# EAGLE design ICE_mod_hbridge_m8 (EAGLE 5.06)
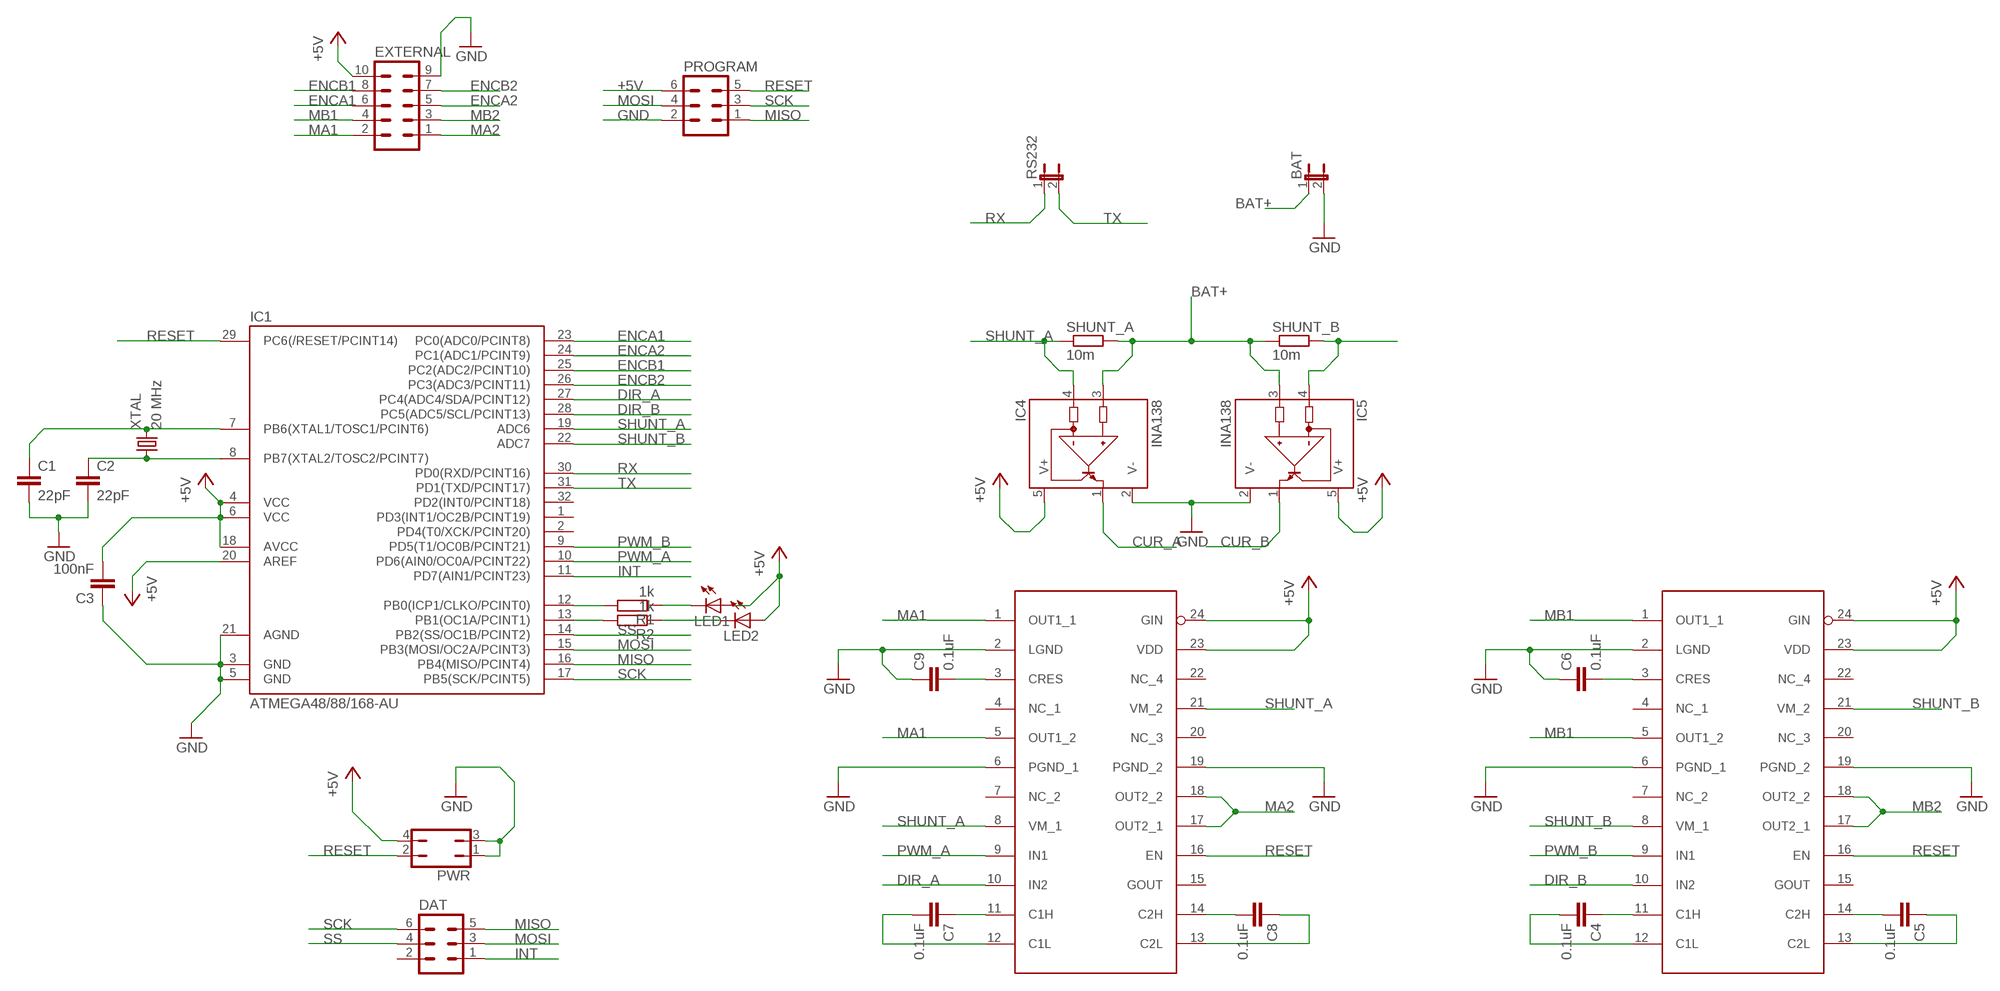
[diagram p0: schematic, sheet 1]

## Parts
BAT  JP1E  [JP1]
C1  22pF  C-EUC0805K  [C0805K]
C2  22pF  C-EUC0805K  [C0805K]
C3  100nF  C-EUC0805K  [C0805K]
C4  0.1uF  C-EUC0805K  [C0805K]
C5  0.1uF  C-EUC0805K  [C0805K]
C6  0.1uF  C-EUC0805K  [C0805K]
C7  0.1uF  C-EUC0805K  [C0805K]
C8  0.1uF  C-EUC0805K  [C0805K]
C9  0.1uF  C-EUC0805K  [C0805K]
DAT  MA03-2  [MA03-2]
EXTERNAL  MA05-2  [MA05-2]
IC1  ATMEGA48/88/168-AU  [TQFP32-08]
IC2  MPC17510  [TSSOP24]
IC3  MPC17510  [TSSOP24]
IC4  INA138  [SOT23-5]
IC5  INA138  [SOT23-5]
LED1  LEDCHIPLED_0805  [CHIPLED_0805]
LED2  LEDCHIPLED_0805  [CHIPLED_0805]
PROGRAM  MA03-2  [MA03-2]
PWR  JP2Q  [JP2Q]
R1  1k  R-EU_R0805W  [R0805W]
R2  1k  R-EU_R0805W  [R0805W]
RS232  JP1E  [JP1]
SHUNT_A  10m  R-EU_R2010  [R2010]
SHUNT_B  10m  R-EU_R2010  [R2010]
XTAL  20 MHz  CRYSTALHC49S  [HC49/S]

## Nets
+5V: C3.2 EXTERNAL.10 IC1.4(VCC) IC1.6(VCC) IC1.18(AVCC) IC1.20(AREF) IC2.23(VDD) IC2.24(GIN) IC3.23(VDD) IC3.24(GIN) IC4.5(V+) IC5.5(V+) LED1.A LED2.A PROGRAM.6 PWR.4
BAT+: BAT.1 IC4.3(IN+) IC5.3(IN+) SHUNT_A.2 SHUNT_B.1
CUR_A: IC4.1(OUT)
CUR_B: IC5.1(OUT)
DIR_A: IC1.27(PC4(ADC4/SDA/PCINT12)) IC2.10(IN2)
DIR_B: IC1.28(PC5(ADC5/SCL/PCINT13)) IC3.10(IN2)
ENCA1: EXTERNAL.6 IC1.23(PC0(ADC0/PCINT8))
ENCA2: EXTERNAL.5 IC1.24(PC1(ADC1/PCINT9))
ENCB1: EXTERNAL.8 IC1.25(PC2(ADC2/PCINT10))
ENCB2: EXTERNAL.7 IC1.26(PC3(ADC3/PCINT11))
GND: BAT.2 C1.2 C2.2 C3.1 C6.1 C9.1 EXTERNAL.9 IC1.3(GND) IC1.5(GND) IC1.21(AGND) IC2.2(LGND) IC2.6(PGND_1) IC2.19(PGND_2) IC3.2(LGND) IC3.6(PGND_1) IC3.19(PGND_2) IC4.2(V-) IC5.2(V-) PROGRAM.2 PWR.1 PWR.3
INT: DAT.1 IC1.11(PD7(AIN1/PCINT23))
MA1: EXTERNAL.2 IC2.1(OUT1_1) IC2.5(OUT1_2)
MA2: EXTERNAL.1 IC2.17(OUT2_1) IC2.18(OUT2_2)
MB1: EXTERNAL.4 IC3.1(OUT1_1) IC3.5(OUT1_2)
MB2: EXTERNAL.3 IC3.17(OUT2_1) IC3.18(OUT2_2)
MISO: DAT.5 IC1.16(PB4(MISO/PCINT4)) PROGRAM.1
MOSI: DAT.3 IC1.15(PB3(MOSI/OC2A/PCINT3)) PROGRAM.4
N$1: C1.1 IC1.7(PB6(XTAL1/TOSC1/PCINT6)) XTAL.2
N$3: C7.1 IC2.11(C1H)
N$4: C7.2 IC2.12(C1L)
N$5: C8.2 IC2.14(C2H)
N$6: C8.1 IC2.13(C2L)
N$7: C4.1 IC3.11(C1H)
N$8: C9.2 IC2.3(CRES)
N$9: C4.2 IC3.12(C1L)
N$10: C5.2 IC3.14(C2H)
N$11: C5.1 IC3.13(C2L)
N$12: C6.2 IC3.3(CRES)
N$13: IC1.12(PB0(ICP1/CLKO/PCINT0)) R1.2
N$14: IC1.13(PB1(OC1A/PCINT1)) R2.2
N$15: LED1.C R1.1
N$16: LED2.C R2.1
N$24: C2.1 IC1.8(PB7(XTAL2/TOSC2/PCINT7)) XTAL.1
PWM_A: IC1.10(PD6(AIN0/OC0A/PCINT22)) IC2.9(IN1)
PWM_B: IC1.9(PD5(T1/OC0B/PCINT21)) IC3.9(IN1)
RESET: IC1.29(PC6(/RESET/PCINT14)) IC2.16(EN) IC3.16(EN) PROGRAM.5 PWR.2
RX: IC1.30(PD0(RXD/PCINT16)) RS232.1
SCK: DAT.6 IC1.17(PB5(SCK/PCINT5)) PROGRAM.3
SHUNT_A: IC1.19(ADC6) IC2.8(VM_1) IC2.21(VM_2) IC4.4(IN-) SHUNT_A.1
SHUNT_B: IC1.22(ADC7) IC3.8(VM_1) IC3.21(VM_2) IC5.4(IN-) SHUNT_B.2
SS: DAT.4 IC1.14(PB2(SS/OC1B/PCINT2))
TX: IC1.31(PD1(TXD/PCINT17)) RS232.2
Unconnected: DAT.2 IC1.1(PD3(INT1/OC2B/PCINT19)) IC1.2(PD4(T0/XCK/PCINT20)) IC1.32(PD2(INT0/PCINT18)) IC2.4(NC_1) IC2.7(NC_2) IC2.15(GOUT) IC2.20(NC_3) IC2.22(NC_4) IC3.4(NC_1) IC3.7(NC_2) IC3.15(GOUT) IC3.20(NC_3) IC3.22(NC_4)

## Library data of the parts
BAT RS232 = jumper:JP1E: JUMPER
C1-C9 = rcl:C-EU: CAPACITOR, European symbol
DAT PROGRAM = con-lstb:MA03-2: PIN HEADER
EXTERNAL = con-lstb:MA05-2: PIN HEADER
IC1 = atmega8:ATMEGA48/88/168
IC2 IC3 = mpc17510:MPC17510
IC4 IC5 = burr-brown:INA138: High-Side Measurement Current Shunt Monitor
LED1 LED2 = led:LED: LED OSRAM: - CHIPLED LG R971, LG N971, LY N971, LG Q971, LY Q971, LO R971, LY R971 LH N974, LH R974 LS Q976, LO Q976, LY Q976 LO Q996 - Hyper CHIPLED LW Q18S LB Q993, LB Q99A, LB R99A - SideLED LS A670, LO A670, LY A670, LG A670, LP A670 LB A673, LV A673, LT A673, LW A673 LH A674 LY A675 LS A676, LA A676, LO A676, LY A676, LW A676 LS A679, LY A679, LG A679 - Hyper Micro SIDELED® LS Y876, LA Y876, LO Y876, LY Y876 LT Y87S - SmartLED LW L88C, LW L88S LB L89C, LB L89S, LG L890 LS L89K, LO L89K, LY L89K LS L896, LA L896, LO L896, LY L896 - TOPLED LS T670, LO T670, LY T670, LG T670, LP T670 LSG T670, LSP T670, LSY T670, LOP T670, LYG T670 LG T671, LOG T671, LSG T671 LB T673, LV T673, LT T673, LW T673 LH T674 LS T676, LA T676, LO T676, LY T676, LB T676, LH T676, LSB T676, LW T676 LB T67C, LV T67C, LT T67C, LS T67K, LO T67K, LY T67K, LW E67C LS E67B, LA E67B, LO E67B, LY E67B, LB E67C, LV E67C, LT E67C LW T67C LS T679, LY T679, LG T679 LS T770, LO T770, LY T770, LG T770, LP T770 LB T773, LV T773, LT T773, LW T773 LH T774 LS E675, LA E675, LY E675, LS T675 LS T776, LA T776, LO T776, LY T776, LB T776 LHGB T686 LT T68C, LB T68C - Hyper Mini TOPLED® LB M676 - Mini TOPLED Santana® LG M470 LS M47K, LO M47K, LY M47K Source: http://www.osram.convergy.de LUXEON: - LUMILED® LXK2-PW12-R00, LXK2-PW12-S00, LXK2-PW14-U00, LXK2-PW14-V00 LXK2-PM12-R00, LXK2-PM12-S00, LXK2-PM14-U00 LXK2-PE12-Q00, LXK2-PE12-R00, LXK2-PE12-S00, LXK2-PE14-T00, LXK2-PE14-U00 LXK2-PB12-K00, LXK2-PB12-L00, LXK2-PB12-M00, LXK2-PB14-N00, LXK2-PB14-P00, LXK2-PB14-Q00 LXK2-PR12-L00, LXK2-PR12-M00, LXK2-PR14-Q00, LXK2-PR14-R00 LXK2-PD12-Q00, LXK2-PD12-R00, LXK2-PD12-S00 LXK2-PH12-R00, LXK2-PH12-S00 LXK2-PL12-P00, LXK2-PL12-Q00, LXK2-PL12-R00 Source: www.luxeon.com KINGBRIGHT: KA-3528ASYC Source: www.kingbright.com
PWR = jumper:JP2Q: JUMPER
R1 R2 = rcl:R-EU_: RESISTOR, European symbol
SHUNT_A SHUNT_B = resistor:R-EU_: RESISTOR, European symbol
XTAL = crystal:CRYSTAL: CRYSTAL

## Board
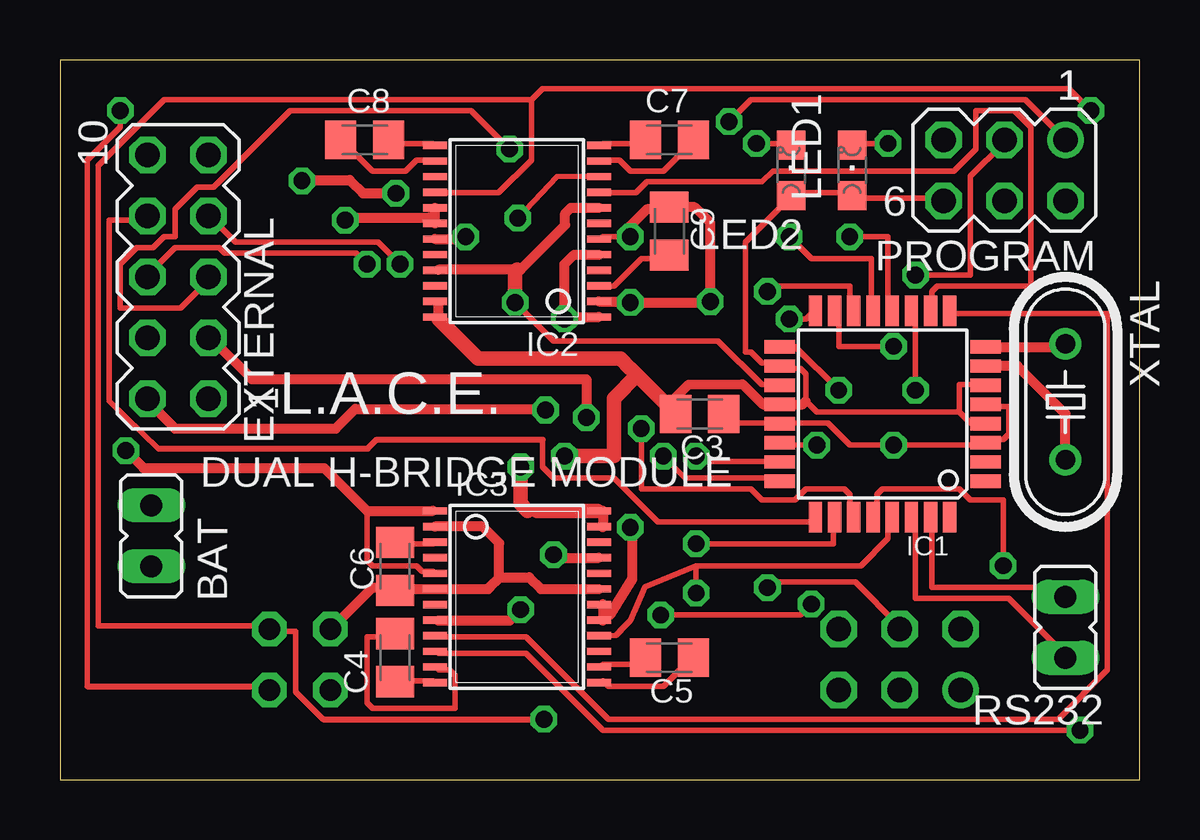
[diagram p1: board, top side]
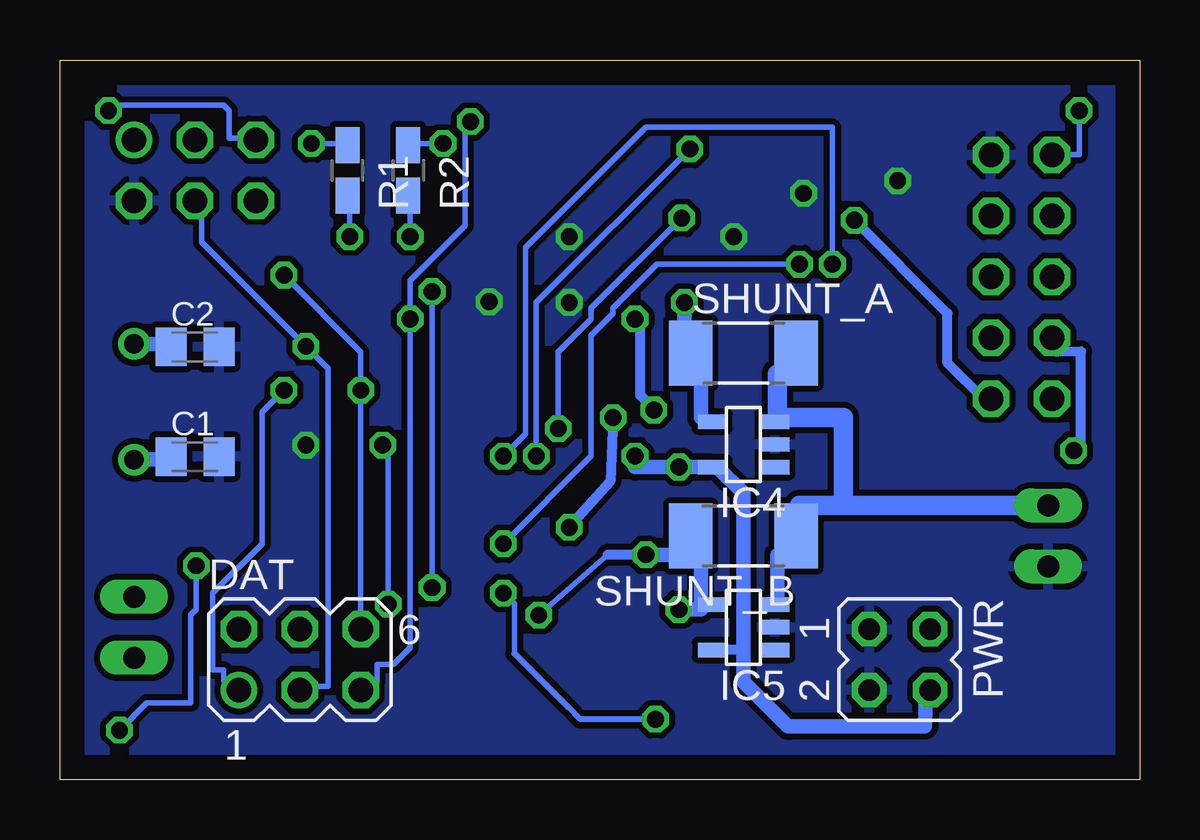
[diagram p2: board, bottom side, seen from below]

Size 45 x 30 mm. Coordinates in mm from the lower left corner, seen from the top.
Outline: 0,0 45,0 45,30 0,30 0,0
Copper layers (1*16): Top 0.035mm / dielectric 1.5mm / Bottom 0.035mm
Design rules "olimex-8mils": minimum track width 8mil, minimum drill 0.6mm, track to track 8mil, track to pad 8mil, pad to pad 8mil, via to via 8mil, smd to smd 8mil, copper to edge 40mil, drill to drill 10mil, minimum pad ring 10mil, minimum via ring 8mil, stop-mask expansion 0mil, vias tented up to drill 0mil, thermal gap 10mil

### Footprints (pad centres in the part's own frame; a part is rotated, then mirrored left to right if it is on the bottom)
JP1 = drill 0.914 long: 1 0,-1.27; 2 0,1.27
C0805K = smd 1.3 x 1.6: 1 -1,0; 2 1,0
MA03-2 = drill 1.016 round: 1 -2.54,-1.27 | drill 1.016 octagon: 2 -2.54,1.27; 3 0,-1.27; 4 0,1.27; 5 2.54,-1.27; 6 2.54,1.27
MA05-2 = drill 1.016 octagon: 1 -5.08,-1.27; 2 -5.08,1.27; 3 -2.54,-1.27; 4 -2.54,1.27; 5 0,-1.27; 6 0,1.27; 7 2.54,-1.27; 8 2.54,1.27; 9 5.08,-1.27; 10 5.08,1.27
TQFP32-08 = smd 1.27 x 0.559: 1 -4.293,2.8; 2 -4.293,2; 3 -4.293,1.2; 4 -4.293,0.4; 5 -4.293,-0.4; 6 -4.293,-1.2; 7 -4.293,-2; 8 -4.293,-2.8; 17 4.293,-2.8; 18 4.293,-2; 19 4.293,-1.2; 20 4.293,-0.4; 21 4.293,0.4; 22 4.293,1.2; 23 4.293,2; 24 4.293,2.8 | smd 0.559 x 1.27: 9 -2.8,-4.293; 10 -2,-4.293; 11 -1.2,-4.293; 12 -0.4,-4.293; 13 0.4,-4.293; 14 1.2,-4.293; 15 2,-4.293; 16 2.8,-4.293; 25 2.8,4.293; 26 2,4.293; 27 1.2,4.293; 28 0.4,4.293; 29 -0.4,4.293; 30 -1.2,4.293; 31 -2,4.293; 32 -2.8,4.293
TSSOP24 = smd 0.305 x 0.991: 1 -3.575,-3.418; 2 -2.925,-3.418; 3 -2.275,-3.418; 4 -1.625,-3.418; 5 -0.975,-3.418; 6 -0.325,-3.418; 7 0.325,-3.418; 8 0.975,-3.418; 9 1.625,-3.418; 10 2.275,-3.418; 11 2.925,-3.418; 12 3.575,-3.418; 13 3.575,3.418; 14 2.925,3.418; 15 2.275,3.418; 16 1.625,3.418; 17 0.975,3.418; 18 0.325,3.418; 19 -0.325,3.418; 20 -0.975,3.418; 21 -1.625,3.418; 22 -2.275,3.418; 23 -2.925,3.418; 24 -3.575,3.418
SOT23-5 = smd 0.6 x 1.2: 1 -0.95,-1.306; 2 0,-1.306; 3 0.95,-1.306; 4 0.95,1.306; 5 -0.95,1.306
CHIPLED_0805 = smd 1.2 x 1.2: A 0,-1.05; C 0,1.05
JP2Q = drill 0.914 octagon: 1 -1.27,-1.27; 2 -1.27,1.27; 3 1.27,-1.27; 4 1.27,1.27
R0805W = smd 1.5 x 1: 1 -1.052,0; 2 1.052,0
R2010 = smd 1.8 x 2.7: 1 -2.2,0; 2 2.2,0
HC49/S = drill 0.813 round: 1 -2.413,0; 2 2.413,0

### Placement (x,y rotation side)
BAT  3.81,10.16 180 top
C1  39.37,13.46 0 bottom
C2  39.37,18.03 0 bottom
C3  26.67,15.24 180 top
C4  13.97,5.08 270 top
C5  25.4,5.08 180 top
C6  13.97,8.89 90 top
C7  25.4,26.67 180 top
C8  12.7,26.67 180 top
C9  25.4,22.86 270 top
DAT  35,5 0 bottom
EXTERNAL  4.92,20.96 90 top
IC1  34.29,15.24 180 top
IC2  19.05,22.86 90 top
IC3  19.05,7.62 270 top
IC4  16.51,13.97 90 bottom
IC5  16.51,6.35 90 bottom
LED1  33.02,25.4 0 top
LED2  30.48,25.4 0 top
PROGRAM  39.37,25.4 180 top
PWR  10,5 270 bottom
R1  33.02,25.4 270 bottom
R2  30.48,25.4 270 bottom
RS232  41.91,6.35 0 top
SHUNT_A  16.51,17.78 0 bottom
SHUNT_B  16.51,10.16 180 bottom
XTAL  41.91,15.75 270 top

### Tracks (layer width: path | path; a pad name or v marks a point on that pad's centre or on a via)
+5V  (via drill 0.7)
  Top 0.229: PROGRAM.6 36.8,24.23 33.15,24.23 LED1.A 32.92,24.46 30.63,24.46 LED2.A 30.4,24.23 28.57,22.4 28.57,17.83 28.8,17.83 29.26,17.37 29.95,17.37 IC1.18 30.18,17.14 30.86,17.14 31.09,16.92 31.09,15.77 31.55,15.32 37.49,15.32 | 22.63,10.52 IC3.23 | 22.4,11.2 IC3.24 | 37.49,15.32 37.95,14.86 38.41,14.86 IC1.4 | 37.49,15.32 37.49,16.46 38.41,16.46 IC1.6 | 15.77,19.43 IC2.24 15.77,19.2 | 15.77,19.89 IC2.23 | 25.6,15.32 C3.2 | v2.52,27.89 2.52,27.2 1.14,25.83 1.14,3.89
  Top 0.254: 8.69,3.89 PWR.4 8.57,3.89 1.14,3.89
  Top 0.406: 22.63,10.52 22.63,11.2 IC3.24 | 15.77,19.43 15.77,19.89 | 25.6,15.32 25.33,15.59 26.2,16.46 28.45,16.49 29.31,15.64 IC1.20 30.96,15.64 31.09,15.77 | 19.89,11.2 19.88,11.21 19.5,11.21 | v19.2,13.03 | 23.07,13.49 23.08,13.5
  Top 0.61: 24.06,16.86 23.77,17.14 23.76,17.14 23.36,17.55 17.43,17.55 15.77,19.2 | 24.06,16.86 25.33,15.59 | 19.89,11.2 22.4,11.2 | 19.5,11.21 19.2,11.5 v19.2,13.03 | v21.03,13.49 23.07,13.49 | 23.08,13.5 23.08,15.89 24.06,16.86
  Bottom 0.229: IC4.5 | v2.52,27.89 2.52,26.06 3.43,26.06 EXTERNAL.10
  Bottom 0.406: PWR.4 8.91,3.66 | 17.59,13.02 IC4.5 | 16.73,5.4 IC5.5 | 16.73,5.4 16.69,5.44 | 16.73,5.4 16.51,5.4 16.51,5.33
  Bottom 0.61: IC4.5 v19.2,13.03 21.03,13.03 v21.03,13.49 | 8.91,3.66 8.95,2.22 14.58,2.21 14.65,2.21 16.51,4.06 16.51,5.33 16.51,11.94 17.59,13.02
BAT+
  Bottom 0.229: 14.4,17.6 SHUNT_A.2 | 15.09,9.37 14.4,10.06 SHUNT_B.1 14.17,10.29 14.17,11.43 | 15.09,7.32 IC5.3 | 15.09,15.09 IC4.3
  Bottom 0.61: 15.09,16.92 14.4,17.6 | 15.09,9.37 15.09,7.32
  Bottom 0.813: 15.09,16.92 15.09,15.09 12.34,15.09 12.34,11.43 | 12.34,11.43 14.17,11.43 | BAT.1 12.34,11.43
DIR_A  (via drill 0.7)
  Top 0.229: v19.09,23.41 20.72,25.13 22.4,25.15 IC2.10 | v24.23,14.63 24.23,12.12 28.8,12.12 29.26,11.66 30.63,11.66 31.09,12.12 32.69,12.12 32.92,11.89 32.92,10.97 IC1.27
  Bottom 0.229: v19.09,23.41 22.86,19.66 22.86,19.2 24.23,17.83 v24.23,14.63
DIR_B  (via drill 0.7)
  Top 0.229: v42.52,2.06 22.63,2.06 19.43,5.26 15.77,5.26 IC3.10 | v39.32,8.91 39.32,11.66 37.95,11.66 37.49,12.12 34.29,12.12 34.06,11.89 34.06,10.97 IC1.28
  Bottom 0.229: v42.52,2.06 41.38,3.2 39.55,3.2 39.55,6.86 39.32,7.09 v39.32,8.91
ENCA1  (via drill 0.7)
  Top 0.229: v26.52,13.49 26.75,13.26 29.95,13.26 IC1.23 | v12.8,21.49 12.34,21.95 6.86,21.95 6.63,22.17 4.8,22.17 3.66,21.03 EXTERNAL.6
  Bottom 0.229: v26.52,13.49 25.6,14.4 25.6,22.17 20.57,27.2 12.8,27.2 v12.8,21.49
ENCA2  (via drill 0.7)
  Top 0.229: v25.15,13.49 26.06,12.57 29.95,12.57 IC1.24 | v18.75,26.29 17.14,27.89 9.6,27.89 6.4,24.69 5.71,24.69 4.8,23.77 4.8,22.63 4.34,22.63 3.89,22.17 3.2,22.17 2.52,21.49 2.52,19.66 5.03,19.66 6.17,20.8 EXTERNAL.5
  Bottom 0.229: v25.15,13.49 25.15,19.89 v18.75,26.29
ENCB1
  Top 0.229: 20.12,14.17 20.12,13.03 20.57,12.57 23.09,12.57 24.92,10.74 31.32,10.74 IC1.25 | 4.12,13.79 2.06,15.77 2.06,23.32 3.43,23.32 EXTERNAL.8
  Top 0.254: 20.12,14.17 13.2,14.17 12.82,13.79 4.13,13.79 4.12,13.79
ENCB2  (via drill 0.7)
  Top 0.229: v26.52,9.83 32.23,9.83 32.23,10.74 IC1.26 | v14.17,21.49 13.26,22.4 7.32,22.4 6.4,23.32 EXTERNAL.7
  Bottom 0.229: v26.52,9.83 22.86,13.49 22.86,18.52 21.95,19.43 21.95,19.66 20.12,21.49 v14.17,21.49
GND  (via drill 0.7)
  Top 0.229: IC1.5 38.63,15.54 39.55,15.54 39.55,14.4 39.32,14.17 38.63,14.17 IC1.3 38.41,13.95 v34.75,13.95 32.92,13.95 32,14.86 30.18,14.86 IC1.21 29.95,14.86 28.12,14.86 27.89,15.09 C3.1 | 14.17,8 C6.1 13.95,8 | 17.91,8 16.92,8 | 23.55,22.86 23.32,22.63 22.63,22.63 IC2.6 | C9.1 25.38,23.77
  Top 0.406: 25.38,23.77 24.46,23.77 23.55,22.86 v23.77,22.63 | 13.95,8 13.03,8 11.43,6.4 PWR.1 | C6.1 14.03,7.95 IC3.6 17.86,7.95 17.91,8 18.35,8.43 | C9.1 26.46,23.86 27.11,23.21 v27.11,19.92 27.08,19.89 v23.77,19.89 23.73,19.93 IC2.2 | IC2.19 16.82,22.54 v16.92,22.63 | v14.01,24.44 12.63,24.44 12.07,24.99 10.14,24.99 10.09,24.94 | IC3.19 20.05,7.95 19.56,8.43 18.35,8.43 | IC3.2 17.62,10.54 18.3,9.86 18.3,8.48 18.35,8.43
  other vias: 10.09,24.97
  pour Bottom (isolate 0.254): 0,30.48 45.72,30.48 45.72,0 0,0
INT  (via drill 0.7)
  Top 0.229: v35.66,16.23 35.66,19.43 IC1.11
  Bottom 0.229: v35.66,16.23 36.58,15.32 36.58,9.83 38.63,7.77 38.63,4.57 38.18,4.57 38.18,4.12 37.72,3.66 DAT.1
MA1  (via drill 0.7)
  Top 0.254: 20.2,15.45 v20.24,15.41
  Top 0.406: EXTERNAL.2 3.66,15.77 4.8,14.63 11.49,14.63 12.31,15.45 20.2,15.45 | IC2.1 21.11,19.29 v21.03,19.2 21.03,21.49 21.43,21.89 IC2.5
  Bottom 0.406: v21.03,19.2 20.8,18.97 20.8,16 v20.24,15.41
MA2  (via drill 0.7)
  Top 0.406: v11.89,23.32 11.89,23.34 11.98,23.43 15.39,23.43 IC2.18 IC2.17
  Bottom 0.406: v11.89,23.32 8,19.43 8,17.37 6.4,15.77 EXTERNAL.1
MB1  (via drill 0.7)
  Top 0.229: 12.8,11.2 12.8,9.14 13.03,8.91 14.86,8.91 15.09,8.69 15.54,8.69 IC3.5 | 15.54,11.2 IC3.1
  Top 0.406: 15.54,11.2 12.8,11.2 11.02,12.99 3.48,12.99 2.75,13.72 v2.74,13.72
  Bottom 0.406: v2.74,13.72 2.45,13.96 2.45,17.85 3.43,17.83 3.43,18.29 EXTERNAL.4
MB2  (via drill 0.7)
  Top 0.229: 22.63,6.63 IC3.17 | 22.63,7.32 IC3.18
  Top 0.406: 22.63,6.63 22.63,7.32 22.93,6.88 23.84,8.36 23.84,10.45 v23.77,10.52 | v21.95,15.09 21.95,16.69 8,16.69 6.4,18.29 EXTERNAL.3
  Bottom 0.406: v23.77,10.52 22.06,12.43 v21.95,15.09
MISO  (via drill 0.7)
  Top 0.229: v30.4,19.2 31.09,19.2 31.32,19.43 IC1.16 | v27.89,27.43 28.8,28.35 40.23,28.35 PROGRAM.1
  Bottom 0.229: DAT.5 32.23,3.66 31.77,4.12 31.77,4.8 31.09,4.8 30.4,5.49 v30.4,19.2 30.4,20.8 28.12,23.09 28.12,27.2 v27.89,27.43
MOSI  (via drill 0.7)
  Top 0.229: v34.75,18.06 32.46,18.06 32.46,19.43 IC1.15
  Bottom 0.229: PROGRAM.4 39.32,24 39.09,23.77 39.09,22.4 v34.75,18.06 33.83,17.14 33.83,3.89 34.98,3.89 DAT.3
N$1
  Top 0.406: IC1.7 39.91,17.24 41.91,15.24 XTAL.2
  Bottom 0.406: C1.1 40.5,13.34
  Bottom 0.61: 40.5,13.34 XTAL.2
N$3
  Top 0.229: IC2.11 22.63,25.83 23.32,25.83 23.77,25.38 25.15,25.38 26.29,26.52 C7.1
N$4
  Top 0.229: IC2.12 22.63,26.52 24.23,26.52 C7.2
N$5
  Top 0.229: IC2.14 15.54,25.83 14.86,25.83 14.4,25.38 13.03,25.38 11.89,26.52 C8.2
N$6
  Top 0.229: IC2.13 15.54,26.52 13.72,26.52 C8.1
N$7
  Top 0.229: IC3.11 15.77,4.57 16.23,4.57 16.46,4.34 16.46,2.97 13.03,2.97 12.8,3.2 12.8,5.94 13.95,5.94 C4.1
N$8
  Top 0.229: IC2.3 22.63,20.57 23.09,20.57 24.23,21.72 25.38,21.72 C9.2
N$9
  Top 0.229: IC3.12 15.54,4.12 14.17,4.12 C4.2
N$10
  Top 0.229: IC3.14 22.63,4.8 24,4.8 24.23,5.03 C5.2
N$11
  Top 0.229: IC3.13 22.63,4.12 22.86,3.89 25.15,3.89 26.29,5.03 C5.1
N$12
  Top 0.229: IC3.3 15.54,9.83 14.17,9.83 C6.2
N$13  (via drill 0.7)
  Top 0.229: v32.92,22.63 34.52,22.63 34.52,19.66 IC1.12
  Bottom 0.229: v32.92,22.63 32.92,24.23 R1.2
N$14  (via drill 0.7)
  Top 0.229: v30.4,22.63 31.32,21.72 33.83,21.72 33.83,19.66 IC1.13
  Bottom 0.229: v30.4,22.63 30.4,24.23 R2.2
N$15  (via drill 0.7)
  Top 0.229: v34.52,26.52 33.15,26.52 LED1.C
  Bottom 0.229: v34.52,26.52 33.15,26.52 LED1.C
N$16  (via drill 0.7)
  Top 0.229: v29.03,26.52 30.4,26.52 LED2.C
  Bottom 0.229: v29.03,26.52 30.4,26.52 LED2.C
N$24
  Top 0.406: IC1.8 41.91,18.04 XTAL.1
  Bottom 0.406: 40.5,18.16 C2.1
  Bottom 0.61: XTAL.1 40.5,18.16
PWM_A
  Top 0.229: IC2.9 22.63,24.46 24,24.46 24.46,24.92 29.26,24.92 29.72,25.38 37.26,25.38 38.18,26.29 38.18,27.89 39.78,27.89 40.46,27.2 40.46,20.57 36.58,20.57 36.35,20.34 36.35,19.66 IC1.10
PWM_B
  Top 0.229: IC3.9 15.77,5.94 19.43,5.94 22.86,2.52 41.6,2.52 43.66,4.57 43.66,19.43 37.26,19.43 IC1.9
RESET  (via drill 0.7)
  Top 0.229: 26.52,8.91 33.38,8.91 34.52,10.06 34.52,10.74 IC1.29 | 26.52,8.91 24.38,8.04 23.77,6.63 23.32,6.17 23.41,6.24 23.18,6.01 IC3.16 | 19.66,28.35 19.66,25.83 18.29,24.46 15.77,24.46 IC2.16 | 19.66,28.35 4.34,28.35 1.6,25.6 1.6,6.4 8.69,6.4 PWR.2 8.91,6.17 9.83,6.17 9.83,3.66 10.97,2.52 | v42.98,27.89 42.06,28.8 20.12,28.8 19.66,28.35 | v26.52,7.77 26.52,8.91
  Top 0.254: 10.97,2.52 v20.18,2.52
  Bottom 0.229: v42.98,27.89 42.98,28.12 38.18,28.12 37.95,27.89 37.95,26.75 37.03,26.75 PROGRAM.5 | v26.52,7.77 26.06,7.32 26.06,5.26
  Bottom 0.254: 26.06,5.26 23.83,3.03 23.32,2.52 v20.18,2.52
RX
  Top 0.229: IC1.30 35.66,10.74 35.66,7.54 39.55,7.54 41.83,5.26 RS232.1
SCK  (via drill 0.7)
  Top 0.229: v32.46,16.23 30.63,18.06 30.18,18.06 IC1.17 | v35.66,21.03 37.95,21.03 37.95,25.15 39.32,26.52 PROGRAM.3
  Bottom 0.229: DAT.6 32.46,6.4 v32.46,16.23 32.46,17.83 v35.66,21.03
SHUNT_A  (via drill 0.7)
  Top 0.229: 15.77,21.26 IC2.21 | v18.97,19.89 20.57,18.29 27.43,18.29 29.26,16.46 29.95,16.46 IC1.19
  Top 0.406: IC2.8 21.3,23.84 21.06,23.6 21.06,23.12 19.2,21.26 19.05,21.26 15.77,21.26
  Top 0.61: v18.97,19.89 18.97,21.18 19.05,21.26
  Bottom 0.229: 18.29,15.09 17.83,15.09 IC4.4 | 18.29,17.37 18.52,17.6 SHUNT_A.1 18.75,17.83 18.97,18.06
  Bottom 0.61: 18.29,15.09 18.29,17.37 | 18.97,18.06 v18.97,19.89
SHUNT_B  (via drill 0.7)
  Top 0.229: IC3.8 15.77,6.63 | v31.55,13.95 30.18,13.95 IC1.22 | v31.32,7.32 30.86,6.86 v25.04,6.86
  Top 0.406: 15.77,6.63 18.75,6.63 v19.2,7.09 | IC3.21 20.7,9.24 v20.57,9.37
  Bottom 0.229: 18.75,9.37 18.75,10.06 SHUNT_B.2 18.75,9.37 | v31.55,13.95 31.32,13.72 v31.32,7.32 | 22.17,9.37 v25.04,6.86 | 18.29,8.91 18.75,9.37 | 18.29,7.09 17.83,7.09 IC5.4 18.29,7.09
  Bottom 0.406: v20.57,9.37 22.17,9.37
  Bottom 0.61: v19.2,7.09 18.29,7.09 18.29,8.91 | 18.75,9.37 v20.57,9.37
SS  (via drill 0.7)
  Top 0.229: v29.49,20.34 29.72,20.57 32.92,20.57 32.92,19.66 IC1.14 | v29.49,8 29.72,8.23 33.15,8.23 34.98,6.4 DAT.4
  Bottom 0.229: v29.49,8 v29.49,20.34
TX
  Top 0.229: IC1.31 36.35,10.74 36.35,8 41.6,8 41.83,7.77 RS232.2

### Text on the board
tNames: L.A.C.E. | DUAL H-BRIDGE MODULE